# EasyEDA Pro project ProPrj_Piano_scan_for_conserts3_2026-02-26.epro, board reuse_sensors-4
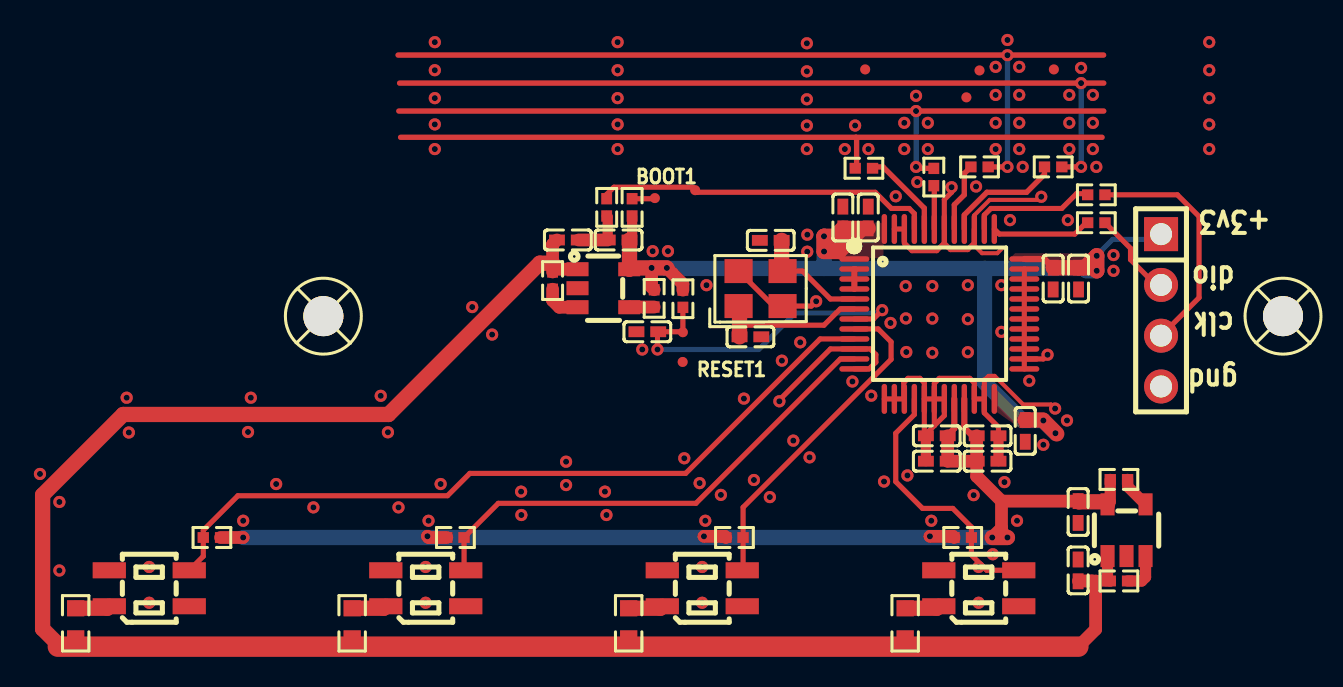
[diagram p12: board, top side]
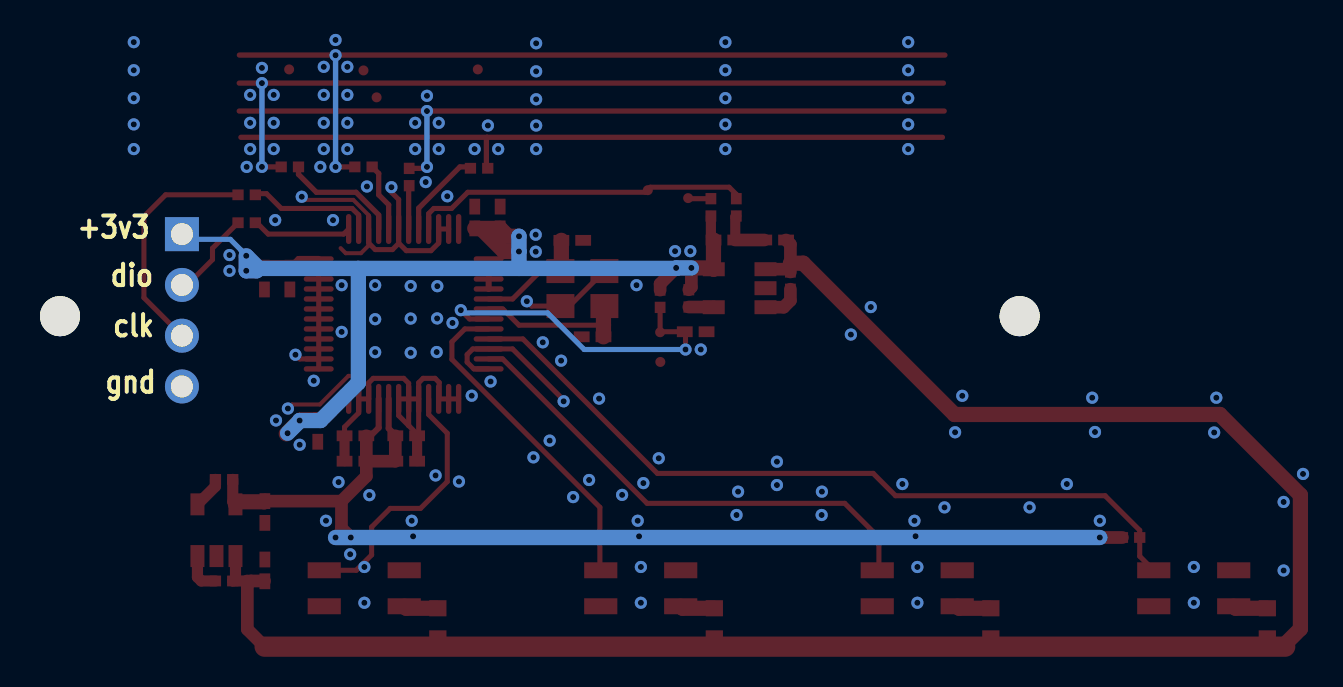
[diagram p13: board, bottom side, seen from below]

No outline. copper layers: Top Layer, Bottom Layer. Coordinates in mm from the lowest, leftmost part position.
Stack: Top Layer 0.035mm / Dielectric1 1.51mm FR4 er 4.5 / Bottom Layer 0.035mm

## Design rules (mm)
template: JLCPCB Capability(Two Layers Board)
spacing copperThickness1oz (default): track to track 0.102, other pairs 0.152 to 0.3
spacing copperThickness2oz: track to track 0.203, other pairs 0.152 to 0.3
track width copperThickness1oz (default): min 0.127, default 0.254, max 2.54
track width copperThickness2oz: min 0.203, default 0.254, max 2.54
differential pair differentialPair (default): width min 0.127, default 0.254, max 2.54; gap min 0.152, default 0.152
via viaSize (default): diameter min 0.5, default 0.61, max 10; hole min 0.3, default 0.305, max 6.3

## Placement (name value [footprint] x y rotation side)
BOOT1  -  [Test-Point-0.5mm]  28.97 21.27 0 top
BOOT2  -  [Test-Point-0.5mm]  30.99 21.67 0 top
C1  10pF  [C0402]  33.75 14.33 0 top
C2  1uF  [C0402]  24.62 19.18 0 top
C3  10pF  [C0402]  34.77 19.16 0 top
C4  1uF  [C0402]  38.37 20.3 90 top
C5  1uF  [C0402]  50.14 2.65 90 top
C6  1uF  [C0402]  50.14 5.57 270 top
C7  100nF  [C0402]  28.59 14.59 180 top
C8  1uF  [C0402]  45.61 8.11 0 top
C9  100nF  [C0402]  43.07 9.38 180 top
C10  1uF  [C0402]  43.07 8.11 180 top
C11  100nF  [C0402]  45.61 9.38 0 top
C12  100nF  [C0402]  47.5 9.63 270 top
C13  100nF  [C0402]  39.64 20.3 90 top
C14  100nF  [C0402]  50.16 17.25 270 top
C15  100nF  [C0402]  48.89 17.25 270 top
C16  10uF  [C0402]  27.16 19.18 180 top
G1  -  [Test-Point-0.5mm]  39.49 27.71 180 top
G2  -  [Test-Point-0.5mm]  44.55 26.32 180 top
G3  -  [Test-Point-0.5mm]  48.93 27.71 180 top
G4  -  [Test-Point-0.5mm]  45.21 27.66 180 top
H1  d  [HDR-TH_4P-P2.54-V-M]  54.29 15.66 270 top
R1  10kΩ  [R0402]  6.82 4.29 180 top
R2  10kΩ  [R0402]  18.99 4.29 0 top
R3  10kΩ  [R0402]  32.95 4.29 0 top
R4  10kΩ  [R0402]  44.37 4.29 0 top
R8  100Ω  [R0603]  0 0 90 top
R9  100Ω  [R0603]  13.83 0 90 top
R10  100Ω  [R0603]  27.66 0 90 top
R11  100Ω  [R0603]  41.49 0 90 top
R15  10kΩ  [R0402]  23.86 17.15 90 top
R16  100kΩ  [R0402]  28.94 16.26 90 top
R17  10kΩ  [R0402]  52.18 2.12 180 top
R18  100kΩ  [R0402]  52.18 7.2 180 top
R19  62Ω  [R0402]  39.43 22.77 180 top
R20  62Ω  [R0402]  42.92 22.33 90 top
R21  62Ω  [R0402]  45.21 22.84 0 top
R22  62Ω  [R0402]  48.89 22.84 0 top
R23  330Ω  [R0402]  27.83 20.81 90 top
R24  10kΩ  [R0402]  30.37 16.24 270 top
R25  10kΩ  [R0402]  26.56 20.81 90 top
R27  33Ω  [R0402]  51.05 20.04 0 top
R28  33Ω  [R0402]  51.05 21.44 0 top
RESET1  -  [Test-Point-0.5mm]  30.36 13.08 0 top
RESSET1  -  [Test-Point-0.5mm]  30.37 14.56 0 top
SCREW1  -  [Screw-Hole-M2]  60.39 15.37 0 top
SCREW2  -  [Screw-Hole-M2]  12.39 15.37 0 top
U1  q  [OPTO-SMD_QRE1113GR]  3.68 1.75 0 top
U2  q  [OPTO-SMD_QRE1113GR]  17.51 1.75 0 top
U3  q  [OPTO-SMD_QRE1113GR]  31.34 1.75 0 top
U4  q  [OPTO-SMD_QRE1113GR]  45.17 1.75 0 top
U8  p1  [TSOT-23-5_L2.9-W1.6-P0.95-LS2.8-BR]  26.4 16.77 180 top
U9  p2  [TSOT-23-5_L2.9-W1.6-P0.95-LS2.8-BR]  52.56 4.66 270 top
U10  STM32G474CBT6  [LQFP-48_L7.0-W7.0-P0.50-LS9.0-BL]  43.2 15.48 270 top
X1  8MHz  [CRYSTAL-SMD_4P-L3.2-W2.5-BL-1]  34.26 16.75 0 top

## Footprints (pads in the part's own frame, mm; a bottom-side part is the same pattern mirrored in y, then rotated)
C0402
  rect 0.79x0.54 smd: 1(-0.545,0) 2(0.545,0)
CRYSTAL-SMD_4P-L3.2-W2.5-BL-1
  rect 1.4x1.2 smd: 1(-1.1,-0.875) 2(1.1,-0.875) 3(1.1,0.875) 4(-1.1,0.875)
HDR-TH_4P-P2.54-V-M
  rect 1.7x1.7 hole 1.1: 1(-3.81,0)
  round 1.7 hole 1.1: 2(-1.27,0) 3(1.27,0) 4(3.81,0)
LQFP-48_L7.0-W7.0-P0.50-LS9.0-BL
  oval 0.27x1.5 smd: 1(-2.75,-4.25) 2(-2.25,-4.25) 3(-1.75,-4.25) 4(-1.25,-4.25) 5(-0.75,-4.25) 6(-0.25,-4.25) 7(0.25,-4.25) 8(0.75,-4.25) 9(1.25,-4.25) 10(1.75,-4.25) 11(2.25,-4.25) 12(2.75,-4.25) 25(2.75,4.25) 26(2.25,4.25) 27(1.75,4.25) 28(1.25,4.25) 29(0.75,4.25) 30(0.25,4.25) 31(-0.25,4.25) 32(-0.75,4.25) 33(-1.25,4.25) 34(-1.75,4.25) 35(-2.25,4.25) 36(-2.75,4.25)
  oval 1.5x0.27 smd: 13(4.25,-2.75) 14(4.25,-2.25) 15(4.25,-1.75) 16(4.25,-1.25) 17(4.25,-0.75) 18(4.25,-0.25) 19(4.25,0.25) 20(4.25,0.75) 21(4.25,1.25) 22(4.25,1.75) 23(4.25,2.25) 24(4.25,2.75) 37(-4.25,2.75) 38(-4.25,2.25) 39(-4.25,1.75) 40(-4.25,1.25) 41(-4.25,0.75) 42(-4.25,0.25) 43(-4.25,-0.25) 44(-4.25,-0.75) 45(-4.25,-1.25) 46(-4.25,-1.75) 47(-4.25,-2.25) 48(-4.25,-2.75)
OPTO-SMD_QRE1113GR
  rect 1.66x0.8 smd: 1(-2,-0.9) 2(2,-0.9) 3(2,0.9) 4(-2,0.9)
R0402
  rect 0.566x0.54 smd: 1(-0.433,0) 2(0.433,0)
R0603
  rect 0.806x0.864 smd: 1(-0.753,0) 2(0.753,0)
Screw-Hole-M2
  round 2 hole 2: 1(0,0)
Test-Point-0.5mm
  round 0.5 smd: 1(0,0)
TSOT-23-5_L2.9-W1.6-P0.95-LS2.8-BR
  rect 1.1x0.7 smd: 1(1.294,-0.951) 2(1.294,-0.001) 3(1.294,0.951) 4(-1.294,0.951) 5(-1.294,-0.949)

## Nets
As in the schematic.

Pads without a net: SCREW1 1; SCREW2 1

## Via types
v1: diameter 0.61, hole 0.305, Top Layer to Bottom Layer, 153 vias

## Routing (per net, layer and track width the routed paths; a pad name or vN(x,y) marks a point on that pad's centre or on a via; arc(x,y) is an arc through that point)
+5V-DC: length 98.7
  Top Layer w0.559: U9.1 51.61,2.26 R17.2 50.84,2.12
  Top Layer w0.635: C2.1 23.86,18.96 R15.2 ; 50.16,2.12 50.84,2.12 51.02,1.94 ; 51.02,1.94 51.02,-0.3 50.15,-1.17 ; 51.02,1.94 51.02,2.12 ; 23.99,17.72 U8.1
  Top Layer w0.762: -0.89,-1.04 -1.65,-0.28 -1.65,6.42 2.38,10.45 15.65,10.45 23.22,18.02 23.86,18.02
  Top Layer w1.016: -0.89,-1.17 50.15,-1.17
GND: length 61.1
  Top Layer w0.203: U10.39 44.95,20.42 45.72,21.18 48.14,21.18 v1(48.3,21.34) ; 45.45,12.18 45.65,12.38 45.96,12.38 47.39,10.95 48.79,10.95 v1(48.99,10.75) ; 46.35,18.77 46.1,18.52 45.34,18.52 44.95,18.91 44.95,19.03
  Top Layer w0.254: U10.26 U10.27 U10.28 U10.29 U10.30 U10.31 U10.32 U10.33 U10.34 U10.35 ; U10.26 U10.25 ; U10.26 48.4,13.23 v1(48.61,13.44) ; 42.95,9.9 42.95,9.9 U10.18 ; 42.95,9.9 42.53,9.47 ; 42.95,9.9 43.45,10.39 U10.19 U10.18 ; v1(35.2,11.11) 35.2,11.17 37.75,13.73 U10.10 39.74,13.73 40.02,13.45 40.02,13.06 39.69,12.73 U10.12 ; v1(43.81,21.82) 43.81,21.57 43.45,21.2 U10.42 ; U10.17 42.45,9.46 C9.2 ; U10.17 U10.18 ; U10.17 42.45,12.04 42.23,12.26 41.63,12.26 41.42,12.05 41.42,11.26 U10.15 U10.14 U10.13 ; U10.18 42.95,12.01 43.2,12.26 44.72,12.26 44.95,12.03 U10.22 U10.23 ; U10.23 45.45,10.53 46.16,9.82 C11.2 ; U10.23 45.45,12.18 ; X1.4 34.91,15.87 X1.2 36.8,15.87 v1(37.04,16.11) ; U10.47 U10.46 41.45,19.03 41.83,18.64 43.07,18.64 43.44,19.02 43.76,18.7 44.62,18.7 44.95,19.03 U10.39
  Top Layer w0.305: U10.2 U10.3 U10.4
  Top Layer w0.508: C11.2 C8.2 ; C16.2 26.61,20.33 R25.1 ; C9.2 C10.2
  Top Layer w0.635: C2.2 C16.2
  vias: v1(-1.79,7.47) v1(-0.82,6.07) v1(-0.82,2.64) v1(2.55,11.29) v1(2.66,9.55) v1(3.68,2.82) v1(3.68,1.03) v1(8.38,5.13) v1(8.62,9.57) v1(8.76,11.29) v1(10.03,6.97) v1(11.89,5.8) v1(15.26,11.38) v1(15.62,9.56) v1(16.15,5.8) v1(17.51,2.82) v1(17.51,1.03) v1(17.65,5.13) v1(17.96,29.08) v1(17.96,27.67) v1(17.96,26.28) v1(17.96,24.96) v1(17.96,23.73) v1(18.26,6.97) v1(19.84,15.82) v1(20.83,14.45) v1(22.28,6.59) v1(22.29,5.42) v1(24.53,8.09) v1(24.53,6.92) v1(26.47,6.59) v1(26.55,5.42) v1(27.11,29.08) v1(27.11,27.67) v1(27.11,26.28) v1(27.11,24.96) v1(27.11,23.73) v1(28.34,13.7) v1(28.86,18.62) v1(29.62,18.62) v1(30.44,8.26) v1(31.21,7.02) v1(31.34,2.82) v1(31.34,1.03) v1(31.49,5.13) v1(31.55,16.92) v1(32.27,6.43) v1(33.43,11.24) v1(33.93,7.17) v1(34.72,6.32) v1(35.32,13.14) v1(35.9,9.14) v1(36.24,14.06) v1(36.57,29.02) v1(36.57,27.62) v1(36.57,26.22) v1(36.57,24.91) v1(36.57,23.73) v1(36.6,19.44) v1(36.59,18.59) v1(36.71,8.3) v1(38.47,23.73) v1(38.85,12.1) v1(38.99,24.91) v1(39.65,23.73) v1(39.8,11.39) v1(40.43,7.09) v1(40.76,15.03) v1(41.02,21.37) v1(41.44,25.04) v1(41.44,23.73) v1(41.52,16.87) v1(41.53,15.25) v1(41.55,13.57) v1(41.6,7.4) v1(42.03,26.39) v1(42.1,22.08) v1(42.62,25.04) v1(42.62,23.73) v1(42.8,5.13) v1(42.85,16.88) v1(42.85,15.25) v1(42.85,13.54) v1(44.62,16.92) v1(44.62,15.22) v1(44.62,13.56) v1(44.92,6.41) v1(45.04,21.86) v1(45.17,1.03) v1(45.88,3.46) v1(46.02,27.84) v1(46.02,26.44) v1(46.02,25.04) v1(46.02,23.73) v1(46.3,16.92) v1(46.3,14.58) v1(46.46,7.06) v1(46.61,29.19) v1(46.73,20.17) v1(47.08,5.13) v1(47.2,27.84) v1(47.2,26.44) v1(47.2,25.04) v1(47.2,23.73) v1(47.37,22.84) v1(47.7,12.14) v1(48.4,8.93) v1(49.63,20.17) v1(49.58,10.15) v1(49.7,26.44) v1(49.7,25.04) v1(49.7,23.73) v1(50.29,27.79) v1(50.88,26.44) v1(50.88,25.04) v1(50.88,23.73) v1(51.05,22.84) v1(51.91,18.43) v1(51.91,17.64) v1(56.7,29.08) v1(56.7,27.67) v1(56.7,26.28) v1(56.7,24.96) v1(56.7,23.73)
VDD: length 59.8
  Top Layer w0.305: C15.1 48.46,18.23 U10.36
  Top Layer w0.508: 27.83,19.31 R23.1
  Top Layer w0.635: v1(29.57,17.78) 30.37,16.98 R24.1 ; C16.1 27.69,19.17 ; R16.2 28.81,16.82 v1(28.81,17.78) ; 49.07,9.45 49.07,9.48
  Top Layer w0.762: 50.48,17.79 50.92,17.79 v1(51.07,17.64) v1(51.07,18.39) 50.48,17.79 ; 50.48,17.79 C14.1 C15.1 ; 27.7,17.73 27.76,17.78 v1(28.81,17.78) v1(29.57,17.78) ; 27.7,17.73 C16.1 ; 27.7,17.73 U8.5 ; C13.1 C4.1 37.98,19.36 v1(37.43,19.36) 37.43,19.36 v1(37.43,18.6) 38.18,18.6 39.24,19.66 ; 49.07,9.48 v1(48.4,10.15) ; C12.1 48.38,10.17
  Bottom Layer w0.254: H1.1 54.03,19.21 51.87,19.21 51.33,18.67 51.33,18.64 v1(51.07,18.39)
  Bottom Layer w0.762: 50.44,17.76 45.46,17.76 ; 50.44,17.76 51,18.32 ; 50.44,17.76 50.56,17.64 v1(51.07,17.64) v1(51.07,18.39) ; 50.44,17.76 50.95,17.76 51,17.71 ; 45.46,17.76 45.46,12.04 47.36,10.15 v1(48.4,10.15) 48.4,10.11 v1(49.01,9.51) ; 45.46,17.76 37.43,17.76 ; 37.43,17.76 37.43,18.6 v1(37.43,18.6) 37.43,19.36 v1(37.43,19.36) ; 37.43,17.76 29.54,17.76 v1(29.57,17.78) ; 29.54,17.78 v1(28.81,17.78)
VDDA: length 63.4
  Top Layer w0.305: 43.62,9.42 43.95,9.75 U10.20 ; U10.21 44.45,9.78 44.85,9.38 C11.1
  Top Layer w0.559: R18.2 51.75,6.09 U9.5
  Top Layer w0.635: C8.1 45.07,7.36 46.31,6.11 ; C8.1 C10.1 C9.1 ; C8.1 C11.1 ; 46.31,6.11 C6.1 ; 46.31,6.11 46.31,4.76 ; v1(31.43,4.35) 32.46,4.35 R3.1 ; v1(46.61,4.29) 46.31,4.59 46.31,4.76 ; 46.31,4.76 v1(45.84,4.29) ; R1.1 v1(8.38,4.29) ; 43.94,4.29 43.88,4.35 v1(42.73,4.35) ; v1(17.59,4.36) 17.66,4.29 R2.1
  Top Layer w0.762: v1(45.84,4.29) v1(46.61,4.29) ; U9.5 51.49,6.08 50.18,6.08 C6.1
  Bottom Layer w0.635: v1(31.43,4.35) 31.43,4.36
  Bottom Layer w0.762: v1(8.38,4.29) v1(45.84,4.29) v1(46.61,4.29)
BOOT0: length 17.1
  Top Layer w0.254: 26.56,21.24 26.56,21.46 26.92,21.82 30.86,21.82 31.11,21.57 39.99,21.57 40.8,20.76 41.69,20.76 41.95,20.5 U10.45
BOOT1: length 1.2
  Top Layer w0.254: 27.83,21.24 28.95,21.24 28.95,21.26 BOOT1.1
COMP1_INP: length 38.8
  Top Layer w0.254: U10.9 37.24,14.23 30.51,7.5 19.72,7.5 18.6,6.38 8.11,6.38 6.38,4.65 R1.2 6.38,3.36 U1.3
COMP2_INP: length 24.9
  Top Layer w0.254: R2.2 19.43,2.74 U2.3 ; U10.11 38.25,13.23 31.02,6 21.14,6 19.43,4.29
COMP3_INP: length 16.6
  Top Layer w0.254: U3.3 33.38,2.7 R3.2 33.38,5.8 40.79,13.21 40.79,14.08 40.14,14.73 U10.8
COMP4_INP: length 13.3
  Top Layer w0.254: U4.3 45.57,2.65 44.8,3.42 R4.2 44.8,4.82 43.87,5.75 42.36,5.75 41.02,7.09 41.02,9.51 41.95,10.44 U10.16
  vias: v1(45.17,2.82)
DEB1: length 4.4
  Top Layer w0.254: H1.2 54.03,16.93 52.76,18.2 52.76,18.77 R27.2
DEB2: length 11.9
  Top Layer w0.254: H1.3 56.19,16.29 56.19,20.35 55.11,21.44 R28.2
PW1: length 1.9
  Top Layer w0.635: R15.1 23.86,16.15 24.19,15.82 U8.3
PW2: length 1.3
  Top Layer w0.635: U8.4 27.7,15.83 28.94,15.83
PW3: length 2
  Top Layer w0.559: 52.61,2.12 53.32,2.12 53.51,2.31 U9.3
PW4: length 1.6
  Top Layer w0.559: 52.61,7.2 52.61,6.85 U9.4
QR1: length 1.7
  Top Layer w0.762: U1.1 1.58,0.75 R8.2
QR2: length 1.7
  Top Layer w0.762: R9.2 15.41,0.75 U2.1
QR3: length 1.7
  Top Layer w0.762: R10.2 29.24,0.75 U3.1
QR4: length 1.7
  Top Layer w0.762: R11.2 43.07,0.75 U4.1
RCC_OSC_IN: length 5.7
  Top Layer w0.254: X1.3 36.35,17.62 37.75,16.23 U10.5
  Top Layer w0.762: X1.3 35.31,17.67 C3.2
RCC_OSC_OUT: length 7.6
  Top Layer w0.254: U10.6 38.24,15.73 37.43,14.92 33.2,14.92
  Top Layer w0.762: C1.1 33.2,15.83 X1.1
RESET: length 17
  Top Layer w0.254: U10.7 39.9,15.23 v1(40.34,15.67) ; v1(29.1,13.7) 29.1,14.55 C7.1 30.37,14.59 R24.2
  Bottom Layer w0.254: v1(40.34,15.67) 40.2,15.53 36,15.53 34.17,13.7 v1(29.1,13.7)
SYS_ITCK-SWCLK: length 6.3
  Top Layer w0.254: R28.1 50.56,21.5 50.06,21.5 49.32,20.76 45.78,20.76 45.45,20.43 U10.38
SYS_ITMS-SWDIO: length 5
  Top Layer w0.254: R27.1 50.54,20.04 49.98,19.47 46.2,19.47 U10.37
TC: length 2.2
  Top Layer w0.264: U10.43 42.95,21.87 42.92,21.89
TIM_CLK: length 39
  Top Layer w0.264: 51.42,25.63 v1(42.03,25.63) 16.16,25.63 ; R20.2 42.11,22.76 v1(42.03,22.84)
  Bottom Layer w0.264: v1(42.03,22.84) v1(42.03,25.63)
TIM_TRIGG: length 36.6
  Top Layer w0.264: 39.03,24.32 39.06,24.28 39.06,22.84 ; 39.03,24.32 51.34,24.32 ; 39.03,24.32 16.25,24.32
TT: length 4.4
  Top Layer w0.264: 39.93,22.84 40.38,22.84 42.45,20.77 U10.44
U_RX: length 40.4
  Top Layer w0.264: 51.42,27.03 v1(50.29,27.03) 16.2,27.03 ; R22.2 v1(50.29,22.84)
  Bottom Layer w0.264: v1(50.29,22.84) v1(50.29,27.03)
U_TX: length 41.8
  Top Layer w0.264: R21.2 v1(46.61,22.84) ; 51.42,28.43 16.13,28.43
  Bottom Layer w0.264: v1(46.61,22.84) v1(46.61,28.42)
UR: length 5.9
  Top Layer w0.264: U10.40 44.45,20.43 45.58,21.57 47.56,21.57 48.46,22.46 R22.1
UT: length 3.5
  Top Layer w0.264: U10.41 43.95,20.94 44.45,21.44 44.45,22.51 R21.1

## Copper pours and planes (outline as drawn; the poured copper is in the pictures)
VDD on Top Layer: 46.86,18.52 51.05,18.52 51.05,17.63 46.86,17.63
VDD on Top Layer: 45.97,11.79 47.37,11.79 47.37,9.75 45.97,9.75
VDD on Top Layer: 38.12,20.05 40.4,20.05 40.4,18.27 38.12,18.27

## Text on the board
Bottom Silkscreen Layer: clk | dio | gnd | +3v3
Top Silkscreen Layer: +3v3 | clk | dio | gnd
